# EAGLE design cerebellar V1.1 (EAGLE 9.6.2)
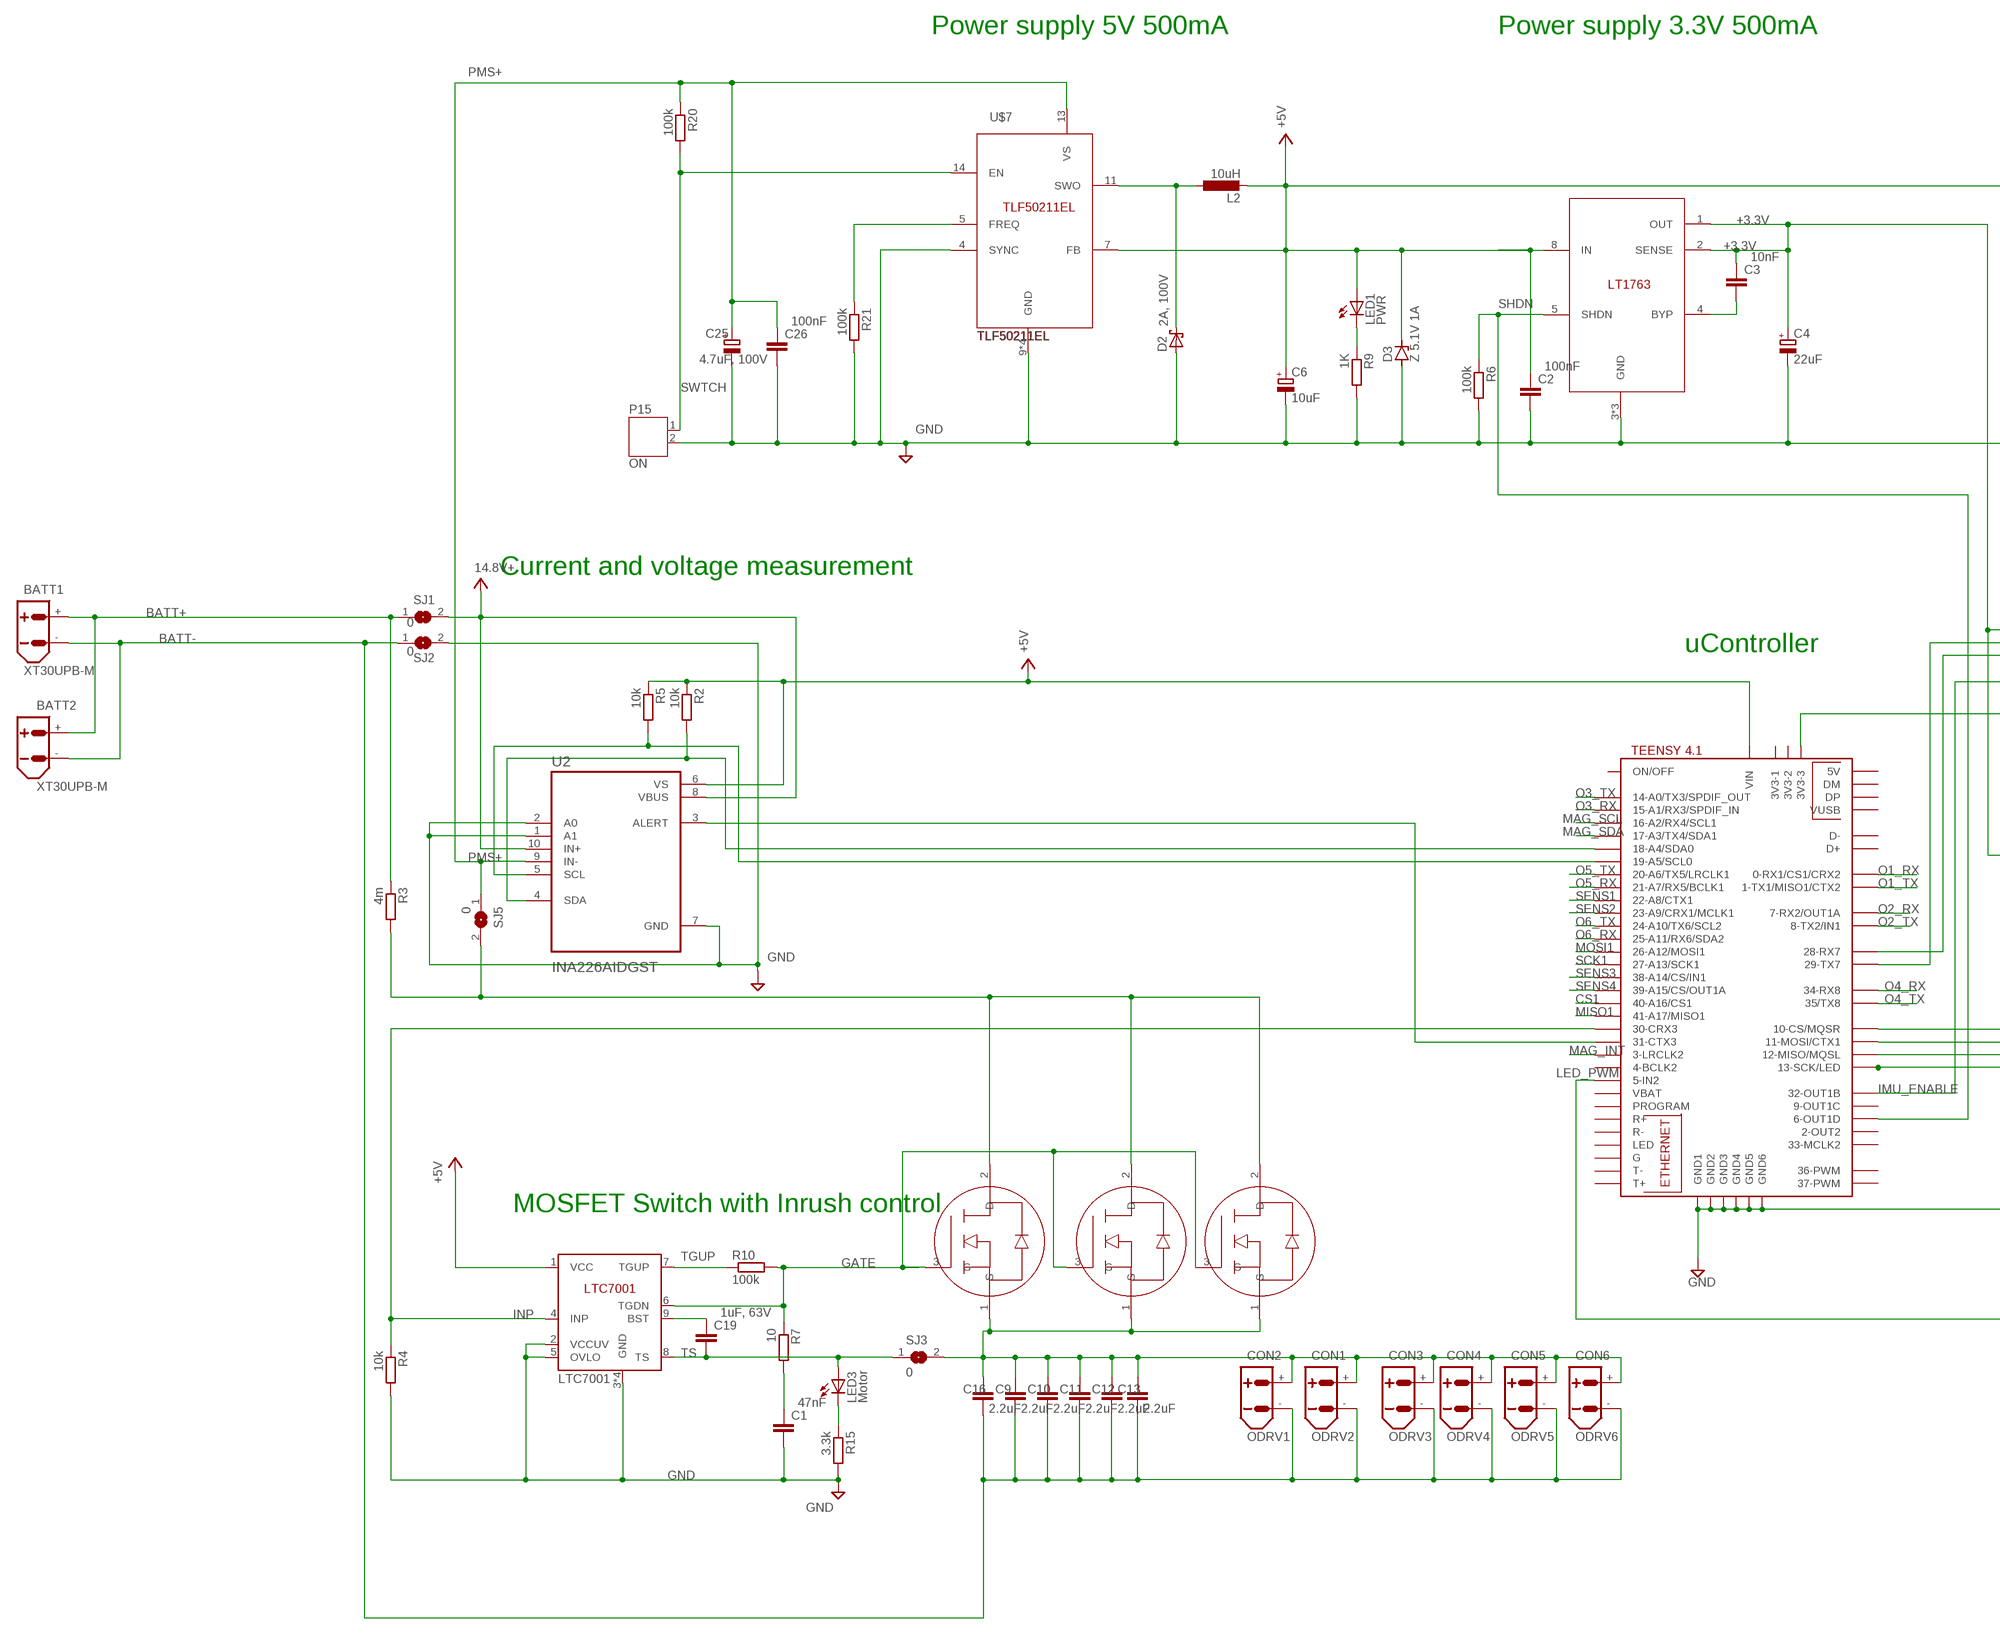
[diagram p0: schematic, sheet 1, part 1 of 2]
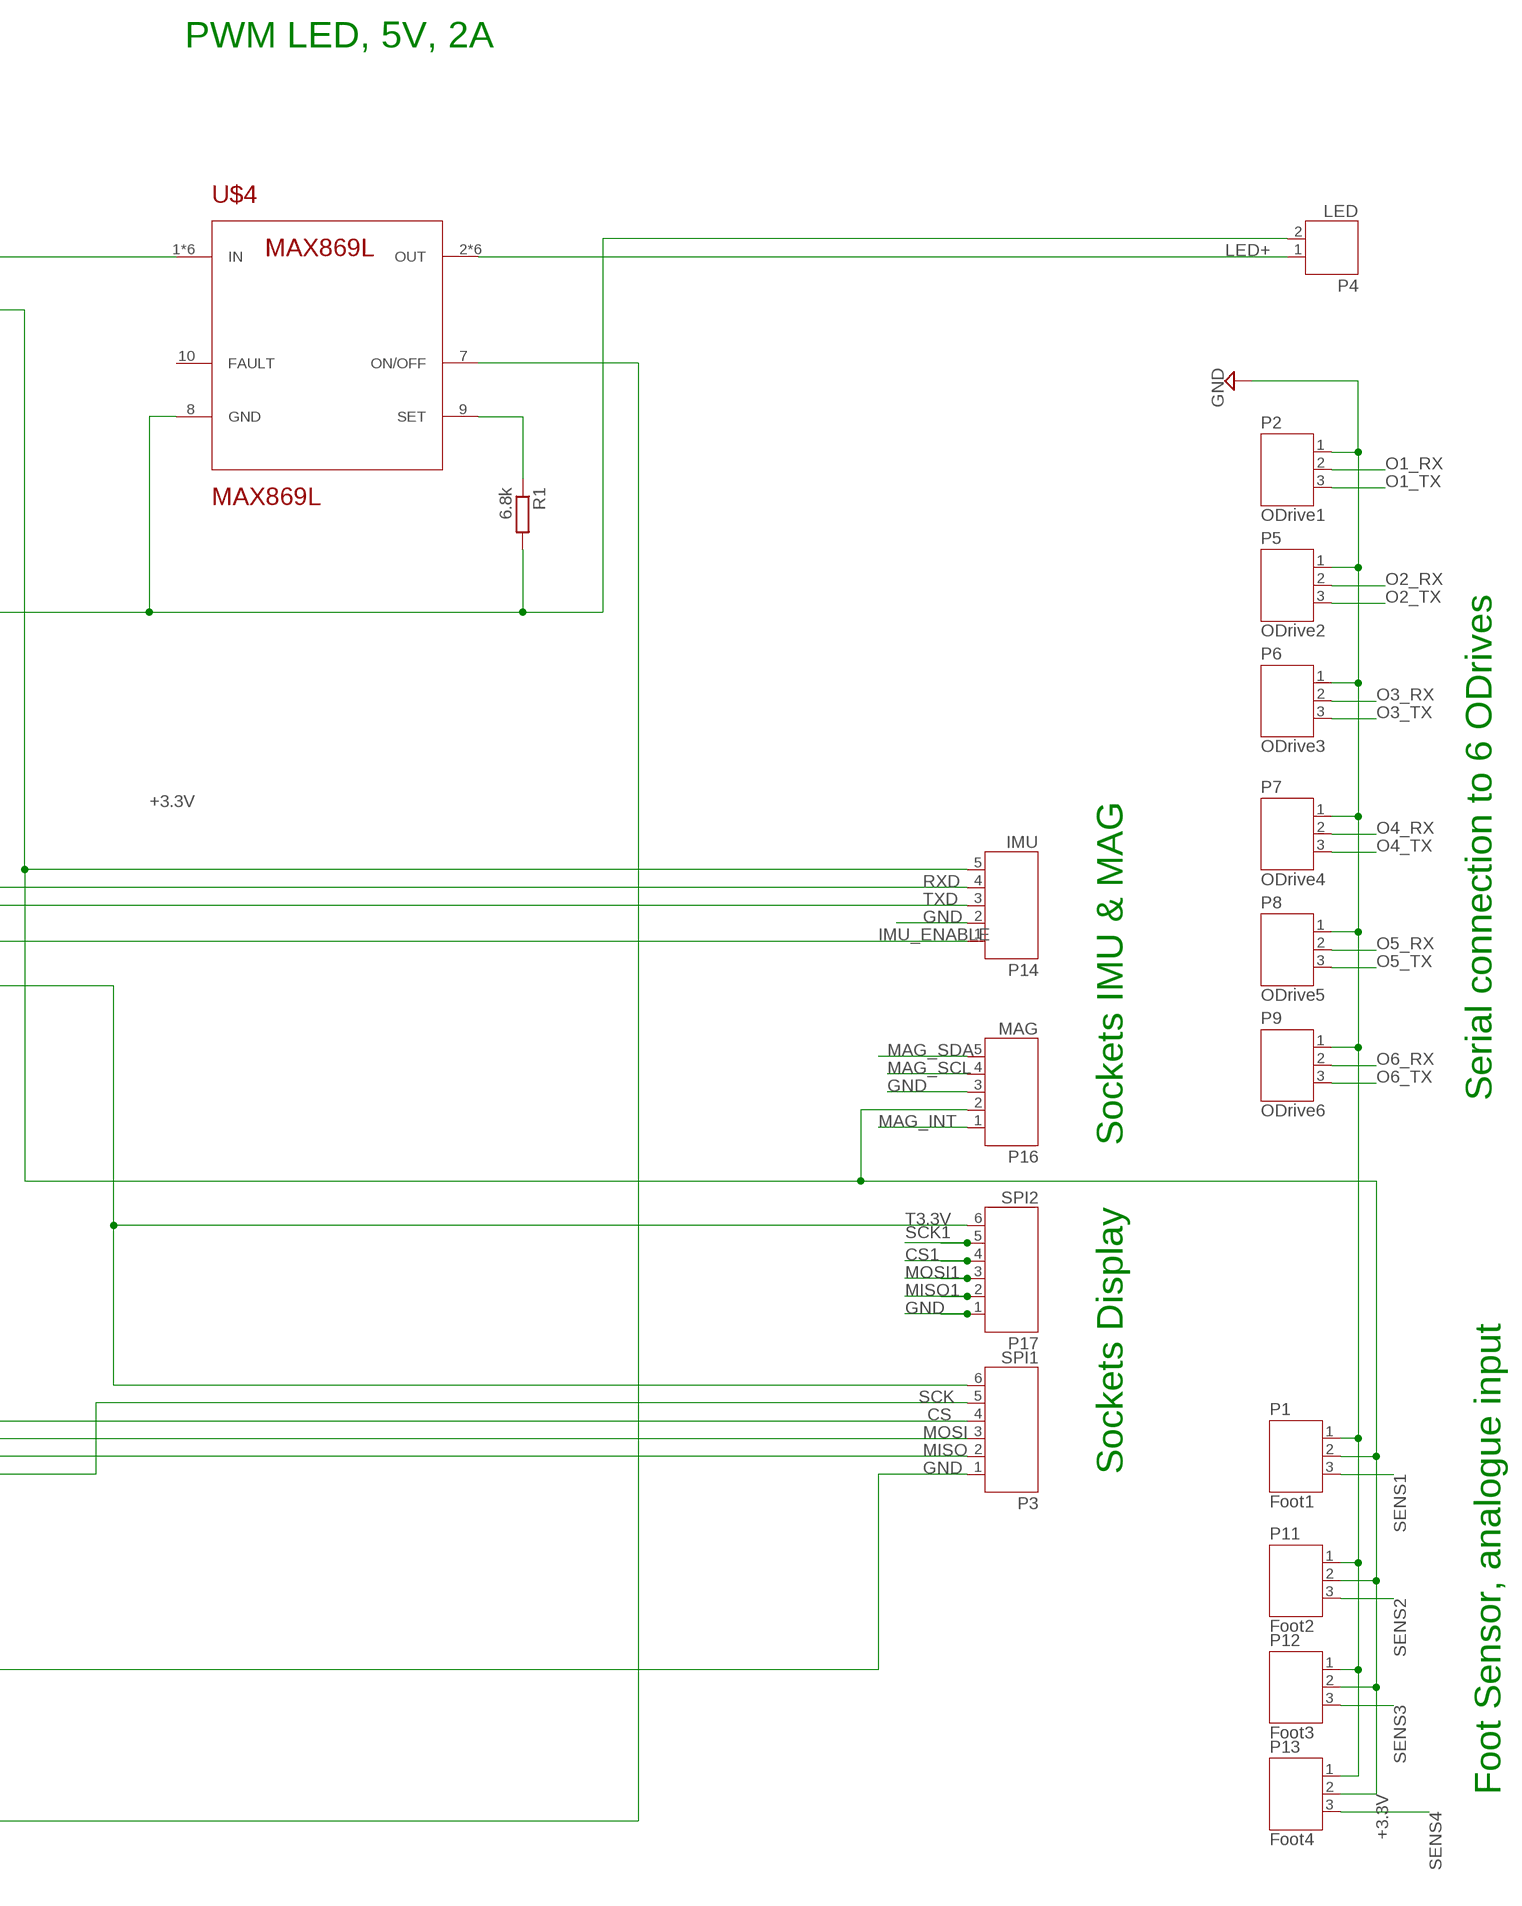
[diagram p1: schematic, sheet 1, part 2 of 2]

## Parts
BATT1  XT30UPB-M  [XT30UPB-M]
BATT2  XT30UPB-M  [XT30UPB-M]
C1  47nF  C-EU050-024X044  [C050-024X044]
C2  100nF  C-EU050-024X044  [C050-024X044]
C3  10nF  C-EU050-024X044  [C050-024X044]
C4  22uF  CPOL-EUE2-4  [E2-4]
C6  10uF  CPOL-EUE2-4  [E2-4]
C9  2.2uF  C-EU050-024X044  [C050-024X044]
C10  2.2uF  C-EU050-024X044  [C050-024X044]
C11  2.2uF  C-EU050-024X044  [C050-024X044]
C12  2.2uF  C-EU050-024X044  [C050-024X044]
C13  2.2uF  C-EU050-024X044  [C050-024X044]
C16  2.2uF  C-EU050-024X044  [C050-024X044]
C19  1uF, 63V  C-EU050-024X044  [C050-024X044]
C25  4.7uF, 100V  CPOL-EUE2-4  [E2-4]
C26  100nF  C-EU050-024X044  [C050-024X044]
CON1  ODRV2  XT30UPB-F  [XT30UPB-F]
CON2  ODRV1  XT30UPB-F  [XT30UPB-F]
CON3  ODRV3  XT30UPB-F  [XT30UPB-F]
CON4  ODRV4  XT30UPB-F  [XT30UPB-F]
CON5  ODRV5  XT30UPB-F  [XT30UPB-F]
CON6  ODRV6  XT30UPB-F  [XT30UPB-F]
D2  2A, 100V  SCHOTTKY-DIODEDO41  [DO41-10]
D3  Z 5.1V 1A  ZENER-DIODEDO41Z10  [DO41Z10]
IC3  LTC7001  [MSOP10]
L2  10uH  L-EUIRF-3  [IRF-3]
LED1  PWR  LED3MM  [LED3MM]
LED3  Motor  LED3MM  [LED3MM]
P1  Foot1  JST-PH3  [JST-PH3]
P2  ODrive1  JST-PH3  [JST-PH3]
P3  SPI1  JST-PH6  [JST-PH6]
P4  LED  JST-PH2  [JST-PH2]
P5  ODrive2  JST-PH3  [JST-PH3]
P6  ODrive3  JST-PH3  [JST-PH3]
P7  ODrive4  JST-PH3  [JST-PH3]
P8  ODrive5  JST-PH3  [JST-PH3]
P9  ODrive6  JST-PH3  [JST-PH3]
P11  Foot2  JST-PH3  [JST-PH3]
P12  Foot3  JST-PH3  [JST-PH3]
P13  Foot4  JST-PH3  [JST-PH3]
P14  IMU  JST-PH5  [JST-PH5]
P15  ON  JST-PH2  [JST-PH2]
P16  MAG  JST-PH5  [JST-PH5]
P17  SPI2  JST-PH6  [JST-PH6]
R1  6.8k  R-EU_0204/7  [0204/7]
R2  10k  R-EU_0204/7  [0204/7]
R3  4m  R-EU_R2512  [R2512]
R4  10k  R-EU_0204/7  [0204/7]
R5  10k  R-EU_0204/7  [0204/7]
R6  100k  R-EU_0204/7  [0204/7]
R7  10  R-EU_0204/7  [0204/7]
R9  1K  R-EU_0204/7  [0204/7]
R10  100k  R-EU_0204/7  [0204/7]
R15  3.3k  R-EU_0204/7  [0204/7]
R20  100k  R-EU_0204/7  [0204/7]
R21  100k  R-EU_0204/7  [0204/7]
SJ1  0  SJ  [SJ]
SJ2  0  SJ  [SJ]
SJ3  0  SJ  [SJ]
SJ5  0  SJ  [SJ]
U2  INA226AIDGST  [SOP50P490X110-10N]
U$1  TEENSY41  [TEENSY41]
U$2  IRF2804-BACK  [TO-220H-BACK]
U$3  IRF2804-BACK  [TO-220H-BACK]
U$4  MAX869L  MAX769L  [TSSOP-16]
U$5  IRF2804-BACK  [TO-220H-BACK]
U$7  TLF50211EL  [TSSOP-14]
U$8  LT1763  [SO08]

## Nets
+3.3V: C3.1 C4.+ P1.2 P11.2 P12.2 P13.2 P14.5 P16.2 U$8.1(OUT) U$8.2(SENSE)
+5V: C2.1 C6.+ D3.C IC3.1(VCC) L2.2 LED1.A R2.1 R5.1 U2.6(VS) U$1.VIN U$4.1(IN) U$4.4(IN) U$4.5(IN) U$4.12(IN) U$4.13(IN) U$4.16(IN) U$7.7(FB) U$8.8(IN)
BATT+ [Battery]: BATT1.+ BATT2.+ R3.1 SJ1.1
BATT- [Battery]: BATT1.- BATT2.- C9.2 C10.2 C11.2 C12.2 C13.2 C16.2 CON1.- CON2.- CON3.- CON4.- CON5.- CON6.- SJ2.1
CS: P3.4 U$1.10-CS\MQSR(10-CS/MQSR)
CS1: P17.4 U$1.40-A16/CS1
DRAIN [Battery]: R3.2 SJ5.2 U$2.2(D) U$3.2(D) U$5.2(D)
GATE: IC3.6(TGDN) R7.1 R10.2 U$2.3(G) U$3.3(G) U$5.3(G)
GND: C1.2 C2.2 C4.- C6.- C25.- C26.2 D2.A D3.A IC3.2(VCCUV) IC3.3(GND) IC3.5(OVLO) IC3.10(GND) IC3.11(GND) IC3.12(GND) P1.1 P2.1 P3.1 P4.2 P5.1 P6.1 P7.1 P8.1 P9.1 P11.1 P12.1 P13.1 P14.2 P15.2 P16.3 P17.1 R1.2 R4.2 R6.2 R9.2 R15.2 R21.2 SJ2.2 U2.1(A1) U2.2(A0) U2.7(GND) U$1.GND1 U$1.GND2 U$1.GND3 U$1.GND4 U$1.GND5 U$1.GND6 U$4.8(GND) U$7.4(SYNC) U$7.9(GND) U$7.10(GND) U$7.15(GND) U$7.16(GND) U$8.3(GND) U$8.6(GND) U$8.7(GND)
IMU_ENABLE: P14.1 U$1.32-OUT1B
INP: IC3.4(INP) R4.1 U$1.30-CRX3
LED+: P4.1 U$4.2(OUT) U$4.3(OUT) U$4.6(OUT) U$4.11(OUT) U$4.14(OUT) U$4.15(OUT)
LED_PWM: U$1.5-IN2 U$4.7(ON/OFF)
MAG_INT: P16.1 U$1.3-LRCLK2
MAG_SCL: P16.4 U$1.16-A2/RX4/SCL1
MAG_SDA: P16.5 U$1.17-A3/TX4/SDA1
MISO: P3.2 U$1.12-MISO/MQSL
MISO1: P17.2 U$1.41-A17/MISO1
MOSI: P3.3 U$1.11-MOSI/CTX1
MOSI1: P17.3 U$1.26-A12/MOSI1
N$1: C1.1 R7.2
N$2: R1.1 U$4.9(SET)
N$5: U2.3(ALERT) U$1.31-CTX3
N$8: C3.2 U$8.4(BYP)
N$17: R5.2 U2.5(SCL) U$1.19-A5/SCL0
N$22: R2.2 U2.4(SDA) U$1.18-A4/SDA0
N$24: C19.1 IC3.9(BST)
N$30: LED3.K(C) R15.1
N$39: LED1.K(C) R9.1
N$42: D2.C L2.1 U$7.11(SWO)
N$46: R21.1 U$7.5(FREQ)
O1_RX: P2.2 U$1.0-RX1/CS1/CRX2
O1_TX: P2.3 U$1.1-TX1/MISO1/CTX2
O2_RX: P5.2 U$1.7-RX2/OUT1A
O2_TX: P5.3 U$1.8-TX2/IN1
O3_RX: P6.2 U$1.15-A1/RX3/SPDIF_IN
O3_TX: P6.3 U$1.14-A0/TX3/SPDIF_OUT
O4_RX: P7.2 U$1.34-RX8
O4_TX: P7.3 U$1.35-TX8(35/TX8)
O5_RX: P8.2 U$1.21-A7/RX5/BCLK1
O5_TX: P8.3 U$1.20-A6/TX5/LRCLK1
O6_RX: P9.2 U$1.25-A11/RX6/SDA2
O6_TX: P9.3 U$1.24-A10/TX6/SCL2
PMS+: C25.+ C26.1 R20.1 SJ5.1 U2.9(IN-) U$7.13(VS)
POWER+ [Battery]: C9.1 C10.1 C11.1 C12.1 C13.1 C16.1 CON1.+ CON2.+ CON3.+ CON4.+ CON5.+ CON6.+ SJ3.2 U$2.1(S) U$3.1(S) U$5.1(S)
RXD: P14.4 U$1.29-TX7
SCK: P3.5 U$1.13-SCK/LED
SCK1: P17.5 U$1.27-A13/SCK1
SENS1: P1.3 U$1.22-A8/CTX1
SENS2: P11.3 U$1.23-A9/CRX1/MCLK1
SENS3: P12.3 U$1.38-A14/CS/IN1
SENS4: P13.3 U$1.39-A15/CS/OUT1A
SHDN: R6.1 U$1.6-OUT1D U$8.5(SHDN)
SWTCH: P15.1 R20.2 U$7.14(EN)
T3.3V: P3.6 P17.6 U$1.3V3-3
TGUP: IC3.7(TGUP) R10.1
TS: C19.2 IC3.8(TS) LED3.A SJ3.1
TXD: P14.3 U$1.28-RX7
V+: SJ1.2 U2.8(VBUS) U2.10(IN+) ; supply symbol labelled 14.8V+
Unconnected: U$1.2-OUT2 U$1.3V3-1 U$1.3V3-2 U$1.4-BCLK2 U$1.9-OUT1C U$1.33-MCLK2 U$1.36-PWM U$1.37-PWM U$1.+5V(5V) U$1.D+ U$1.D- U$1.DM U$1.DP U$1.G U$1.LED U$1.ON/OFF U$1.PROGRAM U$1.R+ U$1.R- U$1.T+ U$1.T- U$1.VBAT U$1.VUSB U$4.10(FAULT)

## Notes on the sheet
- Power supply 5V 500mA | Power supply 3.3V 500mA | PWM LED, 5V, 2A
- Serial connection to 6 ODrives
- Current and voltage measurement
- uController
- Sockets IMU & MAG
- Foot Sensor, analogue input
- Sockets Display
- MOSFET Switch with Inrush control

## Library data of the parts
BATT1 BATT2 CON1-CON6 = amass:XT30: AMASS XT30 connector Store in Japan AMASS XT30 connector <https://szc.jp/ams-xt30>
C1-C3 C9-C13 C16 C19 C26 = rcl:C-EU: CAPACITOR, European symbol; SPICEPREFIX: C
C4 C6 C25 = rcl:CPOL-EU: POLARIZED CAPACITOR, European symbol; SPICEPREFIX: C
D2 = adafruit:SCHOTTKY-DIODE: Schottky Diode
D3 = diode:ZENER-DIODE: Z-Diode
IC3 = LTC7001:LTC7001: Fast 150V High Side NMOS Static Switch Driver Source: https://www.analog.com/en/products/ltc7001.html; MPN: AD7992BRMZ-0; OC_FARNELL: 1078311; OC_NEWARK: 31M4422
L2 = rcl:L-EU: INDUCTOR, European symbol; SPICEPREFIX: L
LED1 LED3 = adafruit:LED: LED OSRAM: - CHIPLED LG R971, LG N971, LY N971, LG Q971, LY Q971, LO R971, LY R971 LH N974, LH R974 LS Q976, LO Q976, LY Q976 LO Q996 - Hyper CHIPLED LW Q18S LB Q993, LB Q99A, LB R99A - SideLED LS A670, LO A670, LY A670, LG A670, LP A670 LB A673, LV A673, LT A673, LW A673 LH A674 LY A675 LS A676, LA A676, LO A676, LY A676, LW A676 LS A679, LY A679, LG A679 - Hyper Micro SIDELED® LS Y876, LA Y876, LO Y876, LY Y876 LT Y87S - SmartLED LW L88C, LW L88S LB L89C, LB L89S, LG L890 LS L89K, LO L89K, LY L89K LS L896, LA L896, LO L896, LY L896 - TOPLED LS T670, LO T670, LY T670, LG T670, LP T670 LSG T670, LSP T670, LSY T670, LOP T670, LYG T670 LG T671, LOG T671, LSG T671 LB T673, LV T673, LT T673, LW T673 LH T674 LS T676, LA T676, LO T676, LY T676, LB T676, LH T676, LSB T676, LW T676 LB T67C, LV T67C, LT T67C, LS T67K, LO T67K, LY T67K, LW E67C LS E67B, LA E67B, LO E67B, LY E67B, LB E67C, LV E67C, LT E67C LW T67C LS T679, LY T679, LG T679 LS T770, LO T770, LY T770, LG T770, LP T770 LB T773, LV T773, LT T773, LW T773 LH T774 LS E675, LA E675, LY E675, LS T675 LS T776, LA T776, LO T776, LY T776, LB T776 LHGB T686 LT T68C, LB T68C - Hyper Mini TOPLED® LB M676 - Mini TOPLED Santana® LG M470 LS M47K, LO M47K, LY M47K Source: http://www.osram.convergy.de/
P1 P2 P5-P9 P11-P13 = jst-ph:JST-PH3
P3 P17 = jst-ph:JST-PH6
P4 P15 = jst-ph:JST-PH2
P14 P16 = jst-ph:JST-PH5
R1 R2 R4-R7 R9 R10 R15 R20 R21 = rcl:R-EU_: RESISTOR, European symbol; SPICEPREFIX: R
R3 = rcl:R-EU_: RESISTOR, European symbol; DIGIKEY: 541-WSK25124L000FEACT-ND; LINK: https://octopart.com/wsk25124l000fea-vishay-41934978?r=sp; MOUSER: 71-WSK25124L000FEA; SPICEPREFIX: R
SJ1-SJ3 SJ5 = jumper:SJ: SMD solder JUMPER
U2 = INA226AIDGST:INA226AIDGST: Check availability <https://pricing.snapeda.com/parts/INA226AIDGST/Texas%20Instruments/view-part?ref=eda>; AVAILABILITY: In Stock; DESCRIPTION: 36V, 16-bit, ultra-precise i2c output current/voltage/power monitor w/alert; MF: Texas Instruments; MP: INA226AIDGST; PACKAGE: VSSOP-10 Texas Instruments; PRICE: None; PURCHASE-URL: https://pricing.snapeda.com/search/part/INA226AIDGST/?ref=eda
U$1 = teensy:TEENSY41
U$2 U$3 U$5 = IRF2804:IRF2804-BACK: N-Channel Power MOSFET
U$4 = MAX869:MAX769L: MAX869L 2A, Current-Limited, High-Side P-Channel Switch with Thermal Shutdown
U$7 = TLF50211EL:TLF50211EL: TLF50211EL 2.2 MHz Step-Down Regulator 500 mA, 5 V, low quiescent current https://www.infineon.com/dgdl/Infineon-TLF50211EL-DS-v01_10-EN.pdf?fileId=5546d46258fc0bc1015969d2af9641e9
U$8 = LT1763:LT1763

## Net classes
0 default: width 0.254 mm
1 Battery: width 1.575 mm

## Board
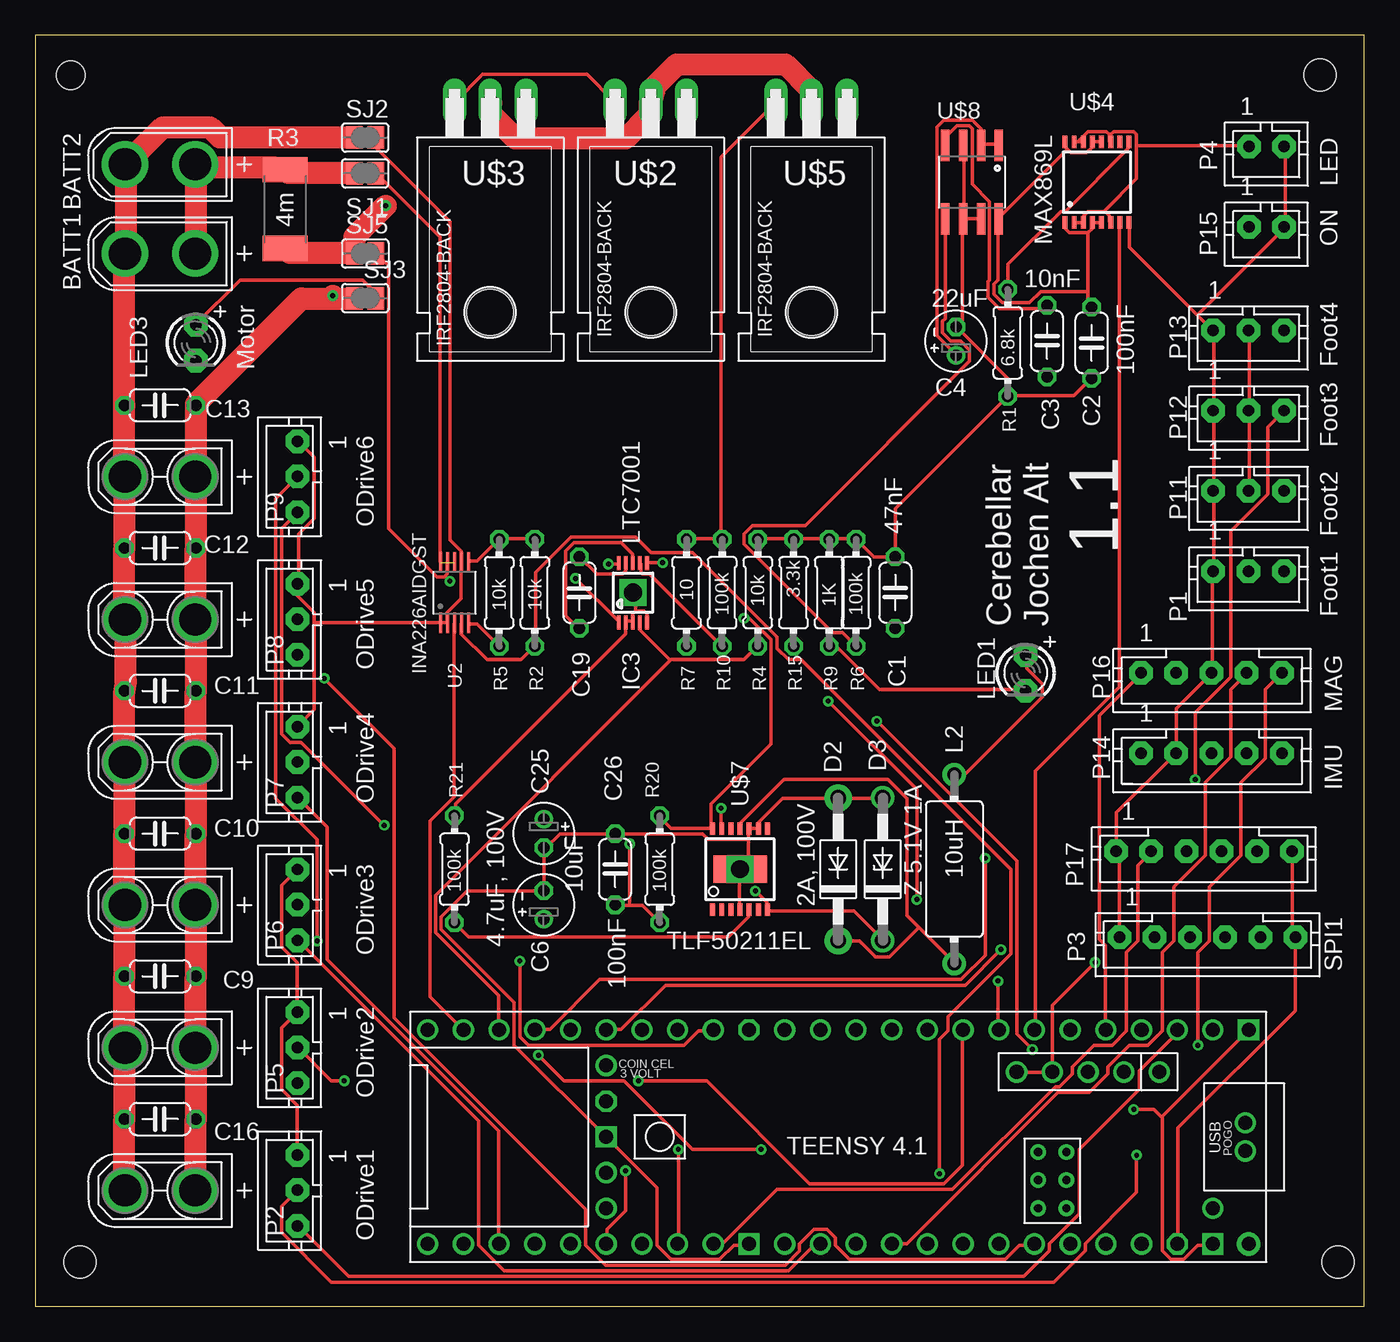
[diagram p2: board, top side]
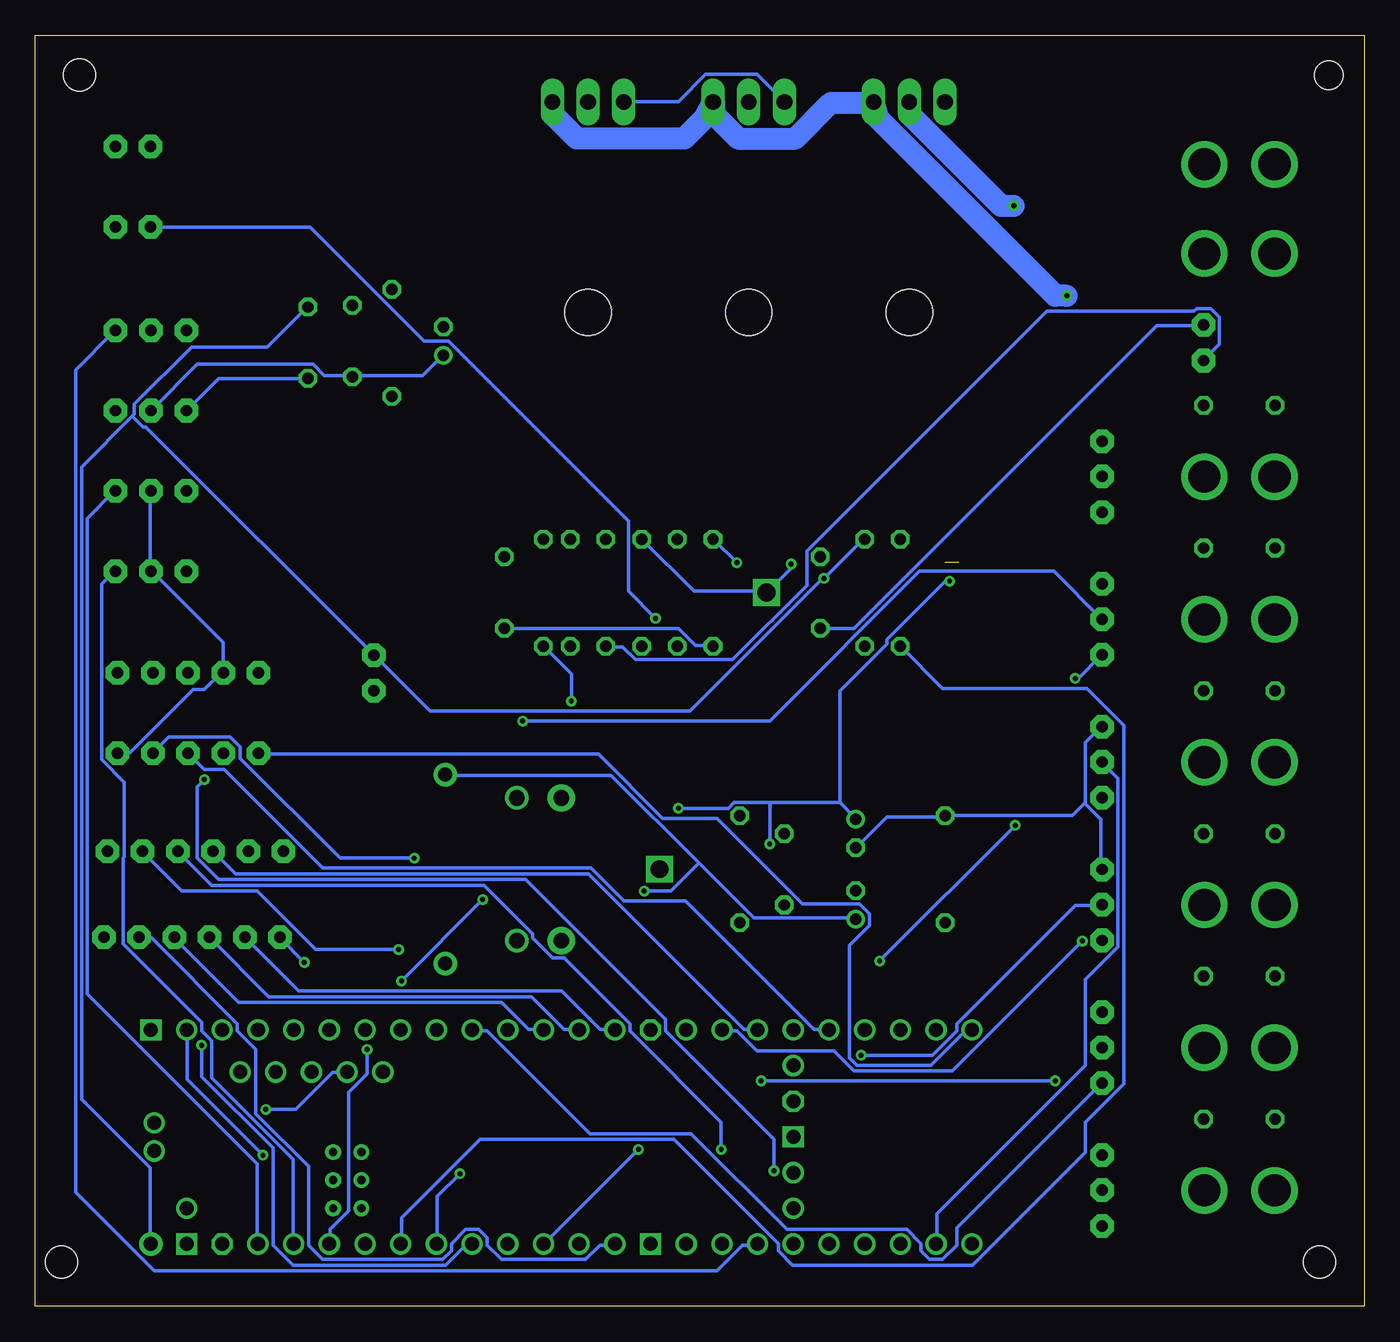
[diagram p3: board, bottom side, seen from below]

Size 94.59 x 90.47 mm. Coordinates in mm from the lower left corner, seen from the top.
Outline: 0,0 94.59,0 94.59,90.47 0,90.47 0,0
Copper layers (1*16): Top 0.035mm / dielectric 1.5mm / Bottom 0.035mm
Design rules "default": minimum track width 6mil, minimum drill 0.35mm, track to track 6mil, track to pad 6mil, pad to pad 6mil, via to via 6mil, smd to smd 6mil, copper to edge 40mil, drill to drill 6mil, minimum pad ring 10mil, minimum via ring 8mil, stop-mask expansion 4mil, vias tented up to drill 0mil, thermal gap 10mil
Holes 2.03 mm at 2.54,87.63
Holes 2.29 mm at 3.17,3.17 91.44,87.63 92.71,3.17

### Footprints (pad centres in the part's own frame; a part is rotated, then mirrored left to right if it is on the bottom)
XT30UPB-M = drill 2.286: + 2.5,0; - -2.5,0
C050-024X044 = drill 0.813 octagon: 1 -2.54,0; 2 2.54,0
E2-4 = drill 0.813 pad 1.27: + -1.016,0 | drill 0.813 pad 1.27 octagon: - 1.016,0
XT30UPB-F = drill 2.286: + 2.5,0; - -2.5,0
DO41-10 = drill 1.118 pad 1.93: A 5.08,0; C -5.08,0
DO41Z10 = drill 1.118: A 5.08,0; C -5.08,0
MSOP10 = smd 0.25 x 1: 1 -1,-2.113; 2 -0.5,-2.113; 3 0,-2.113; 4 0.5,-2.113; 5 1,-2.113; 6 1,2.113; 7 0.5,2.113; 8 0,2.113; 9 -0.5,2.113; 10 -1,2.113 | drill 1.27 square: 11 0,0 | smd 1.524 x 1.524: 12 0,0
IRF-3 = drill 1 pad 1.676: 1 -6.705,0; 2 6.73,0
LED3MM = drill 0.813 pad 1.676 octagon: A -1.27,0; K 1.27,0
JST-PH3 = drill 0.813 pad 1.676 octagon: 1 2.524,-1.524; 2 0.016,-1.524; 3 -2.524,-1.524
JST-PH6 = drill 0.813 pad 1.676 octagon: 1 6.27,0; 2 3.762,0; 3 1.254,0; 4 -1.254,0; 5 -3.762,0; 6 -6.27,0
JST-PH2 = drill 0.813 pad 1.676 octagon: 1 1.254,0; 2 -1.254,0
JST-PH5 = drill 0.813 pad 1.676 octagon: 1 5.762,0; 2 3.254,0; 3 0.746,0; 4 -1.762,0; 5 -4.27,0
0204/7 = drill 0.813 octagon: 1 -3.81,0; 2 3.81,0
R2512 = smd 1.8 x 3.2: 1 -2.8,0; 2 2.8,0
SJ = smd 1.168 x 1.6: 1 -0.762,0; 2 0.762,0
SOP50P490X110-10N = smd 1.47 x 0.28: 1 -2.15,1; 2 -2.15,0.5; 3 -2.15,0; 4 -2.15,-0.5; 5 -2.15,-1; 6 2.15,-1; 7 2.15,-0.5; 8 2.15,0; 9 2.15,0.5; 10 2.15,1
TEENSY41 = drill 1: 0-RX1/CS1/CRX2 -27.94,-7.62; 1-TX1/MISO1/CTX2 -25.4,-7.62; 2-OUT2 -22.86,-7.62; 3-LRCLK2 -20.32,-7.62; 4-BCLK2 -17.78,-7.62; 5-IN2 -15.24,-7.62; 6-OUT1D -12.7,-7.62; 7-RX2/OUT1A -10.16,-7.62; 8-TX2/IN1 -7.62,-7.62; 9-OUT1C -5.08,-7.62; 10-CS\MQSR -2.54,-7.62; 11-MOSI/CTX1 0,-7.62; 12-MISO/MQSL 2.54,-7.62; 13-SCK/LED 2.54,7.62; 14-A0/TX3/SPDIF_OUT 0,7.62; 15-A1/RX3/SPDIF_IN -2.54,7.62; 16-A2/RX4/SCL1 -5.08,7.62; 17-A3/TX4/SDA1 -7.62,7.62; 18-A4/SDA0 -10.16,7.62; 19-A5/SCL0 -12.7,7.62; 20-A6/TX5/LRCLK1 -15.24,7.62; 21-A7/RX5/BCLK1 -17.78,7.62; 22-A8/CTX1 -20.32,7.62; 23-A9/CRX1/MCLK1 -22.86,7.62; 24-A10/TX6/SCL2 7.62,-7.62; 25-A11/RX6/SDA2 10.16,-7.62; 26-A12/MOSI1 12.7,-7.62; 27-A13/SCK1 15.24,-7.62; 28-RX7 17.78,-7.62; 29-TX7 20.32,-7.62; 30-CRX3 22.86,-7.62; 31-CTX3 25.4,-7.62; 32-OUT1B 27.94,-7.62; 33-MCLK2 27.94,7.62; 34-RX8 25.4,7.62; 35-TX8 22.86,7.62; 36-PWM 20.32,7.62; 37-PWM 17.78,7.62; 38-A14/CS/IN1 15.24,7.62; 39-A15/CS/OUT1A 12.7,7.62; 40-A16/CS1 10.16,7.62; 41-A17/MISO1 7.62,7.62; +5V -24.13,-4.62; D+ -30.25,-1; D- -30.25,1; DM -21.59,-4.62; DP -19.05,-4.62; GND4 -16.51,-4.62; GND5 -13.97,-4.62; ON/OFF 15.24,5.08; PROGRAM 15.24,2.54; VBAT 15.24,-5.08; VUSB -27.94,5.08 | drill 1 octagon: 3V3-1 5.08,-7.62; 3V3-2 15.24,-2.54; 3V3-3 -25.4,7.62 | drill 0.6: G -15.51,3.08; LED -17.51,3.08; R+ -17.51,5.08; R- -15.51,5.08; T+ -15.51,1.08; T- -17.51,1.08 | drill 1 square: GND1 -30.48,-7.62; GND2 15.24,0; GND3 5.08,7.62; GND6 -27.94,7.62 | drill 1 pad 1.676: VIN -30.48,7.62
TO-220H-BACK = drill 1.118 long: 1 -2.54,-7.62; 2 0,-7.62; 3 2.54,-7.62 | hole 3.302: 0,7.366
TSSOP-16 = smd 0.9 x 0.35: 1 -2.875,2.275; 2 -2.875,1.625; 3 -2.875,0.975; 4 -2.875,0.325; 5 -2.875,-0.325; 6 -2.875,-0.975; 7 -2.875,-1.625; 8 -2.875,-2.275; 9 2.875,-2.275; 10 2.875,-1.625; 11 2.875,-0.975; 12 2.875,-0.325; 13 2.875,0.325; 14 2.875,0.975; 15 2.875,1.625; 16 2.875,2.275
TSSOP-14 = smd 0.9 x 0.35: 1 -2.875,1.95; 2 -2.875,1.3; 3 -2.875,0.65; 4 -2.875,0; 5 -2.875,-0.65; 6 -2.875,-1.3; 7 -2.875,-1.95; 8 2.875,-1.95; 9 2.875,-1.3; 10 2.875,-0.65; 11 2.875,0; 12 2.875,0.65; 13 2.875,1.3; 14 2.875,1.95 | smd 1.93 x 3.81: 15 0,0 | drill 1.27 square: 16 0,0
SO08 = smd 0.61 x 2.21: 1 -1.905,-2.616; 2 -0.635,-2.616; 3 0.635,-2.616; 4 1.905,-2.616; 5 1.905,2.616; 6 0.635,2.616; 7 -0.635,2.616; 8 -1.905,2.616

### Placement (x,y rotation side)
BATT1  8.89,74.93 0 top
BATT2  8.89,81.28 0 top
C1  61.21,50.8 90 top
C2  75.18,68.58 270 top
C3  72.01,68.71 90 top
C4  65.53,68.71 90 top
C6  36.2,28.57 90 top
C9  8.89,23.5 180 top
C10  8.89,33.66 180 top
C11  8.89,43.81 180 top
C12  8.89,53.98 180 top
C13  8.89,64.14 180 top
C16  8.89,13.34 180 top
C19  38.73,50.8 270 top
C25  36.2,33.66 270 top
C26  41.27,31.11 90 top
CON1  8.89,18.41 0 top
CON2  8.89,8.26 0 top
CON3  8.89,28.57 0 top
CON4  8.89,38.73 0 top
CON5  8.89,48.9 0 top
CON6  8.89,59.05 0 top
D2  57.15,31.11 90 top
D3  60.33,31.11 90 top
IC3  42.55,50.8 0 top
L2  65.41,31.11 90 top
LED1  70.48,45.09 270 top
LED3  11.43,68.58 270 top
P1  86.36,50.8 180 top
P2  17.14,8.26 90 top
P3  83.44,26.29 180 top
P4  87.63,82.55 180 top
P5  17.14,18.41 90 top
P6  17.14,28.57 90 top
P7  17.14,38.73 90 top
P8  17.14,48.9 90 top
P9  17.14,59.05 90 top
P11  86.36,56.52 180 top
P12  86.36,62.23 180 top
P13  86.36,67.94 180 top
P14  84.45,39.37 180 top
P15  87.63,76.83 180 top
P16  84.45,45.09 180 top
P17  83.18,32.38 180 top
R1  69.22,68.58 270 top
R2  35.56,50.8 270 top
R3  17.78,78.11 270 top
R4  51.44,50.8 90 top
R5  33.02,50.8 270 top
R6  58.42,50.8 90 top
R7  46.36,50.8 270 top
R9  56.52,50.8 90 top
R10  48.9,50.8 90 top
R15  53.98,50.8 90 top
R20  44.45,31.11 90 top
R21  29.84,31.11 90 top
SJ1  23.49,80.64 0 top
SJ2  23.49,83.19 0 top
SJ3  23.49,71.75 180 top
SJ5  23.49,74.93 180 top
U2  29.84,50.8 90 top
U$1  55.88,12.06 180 top
U$2  43.82,78.11 180 top
U$3  32.38,78.11 180 top
U$4  75.56,80.01 90 top
U$5  55.25,78.11 180 top
U$7  50.16,31.11 90 top
U$8  66.67,80.01 180 top

### Tracks (layer width: path | path; a pad name or v marks a point on that pad's centre or on a via)
+3.3V
  Top 0.254: U$8.1 68.53,82.7 67.31,82.7 U$8.2 67.31,83.82 66.7,84.43 64.67,84.43 64.16,83.92 64.16,69.09 65.48,67.77 C4.+ | P13.2 86.41,69.39 86.41,63.8 P12.2 86.41,63.7 86.41,58.12 P11.2
  Bottom 0.254: C4.+ 65.58,67.67 67,66.24 71.98,66.24 C3.1 72.08,66.24 74.02,66.24 74.83,67.06 83.06,67.06 86.31,63.8 P12.2 | P14.5 88.65,39.42 87.83,39.42 83.36,43.89 82.55,43.89 81.33,45.11 P16.2 81.23,45.11 81.23,47.24 86.31,52.32 P1.2 86.41,52.43 86.41,58.01 P11.2
+5V  (via drill 0.35)
  Top 0.254: U2.6 30.94,53.03 31.45,53.03 R5.1 33.07,54.66 35.51,54.66 R2.1 | v38.46,51.82 41.5,48.77 IC3.1 | D3.C 60.3,26.11 58.27,28.14 52.17,28.14 U$7.7 52.07,28.35 52.07,28.75 v51.26,29.57 | LED1.A 70.56,46.33 70.56,45.41 71.68,44.3 71.68,43.38 66.19,37.9 65.48,37.9 L2.2 | 73.46,82.35 73.71,82.09 74.83,82.09 75.23,82.5 75.23,82.8 U$4.13 75.34,82.91 75.84,82.91 U$4.12 | 73.46,82.35 73.3,82.5 73.3,82.8 U$4.16 | 73.46,82.35 68.53,77.42 U$8.8 68.53,77.32 68.53,73.05 68.22,72.75 68.22,72.03 68.83,71.42 70.76,71.42 71.58,72.24 74.93,72.24 | 74.93,76.4 73.61,76.4 73.3,76.71 73.3,77.11 U$4.1 | 74.93,76.4 75.23,76.71 75.23,77.11 U$4.4 75.34,77.11 75.84,77.11 U$4.5 | 74.93,72.24 74.93,71.32 75.13,71.12 C2.1 | 74.93,72.24 74.93,76.4
  Bottom 0.254: R2.1 35.61,54.66 v38.46,51.82 38.56,51.82 48.01,42.37 66.5,42.37 LED1.A 86.72,62.59 86.92,62.59 87.68,63.35 | 47.35,31.55 53.59,37.8 65.38,37.8 L2.2 | 47.35,31.55 43.43,27.64 36.22,27.64 C6.+ | v51.26,29.57 49.33,29.57 47.35,31.55 | 87.68,63.35 87.53,63.5 87.53,64.21 83.46,68.28 78.08,68.28 75.23,71.12 C2.1 | 87.68,63.35 91.29,59.74 91.29,14.73 86.41,9.86 86.41,4.47 U$1.VIN
BATT+
  Top 1.575: SJ1.1 22.71,80.67 18.03,80.67 17.83,80.87 R3.1 17.02,81.08 11.63,81.08 11.43,81.28 BATT2.+ 11.43,80.37 11.43,74.98 BATT1.+
BATT-
  Top 1.575: SJ2.1 22.71,83.21 13.16,83.21 12.45,83.92 9.09,83.92 6.45,81.28 BATT2.- 6.45,80.57 6.45,74.98 BATT1.- 6.35,74.17 C13.2 6.35,64.11 6.35,59.13 CON6.- 6.35,58.32 C12.2 6.35,53.95 6.35,48.97 CON5.- 6.45,48.16 6.45,44.5 6.35,43.79 | CON2.- 6.35,8.33 6.35,13.31 C16.2 6.35,17.68 CON1.- 6.35,18.49 6.35,23.47 C9.2 6.35,27.84 CON3.- 6.35,28.65 6.35,33.63 C10.2 6.35,38 CON4.- 6.35,38.81 6.35,43.79 | 6.35,43.79 C11.2
CS
  Bottom 0.254: U$1.10-CS\MQSR 58.47,19.71 59.49,19.71 61.42,21.64 80.11,21.64 84.68,26.21 P3.4
CS1  (via drill 0.35)
  Top 0.254: v45.77,11.18 45.77,4.47 U$1.40-A16/CS1
  Bottom 0.254: v45.77,11.18 45.77,13.11 52.27,19.61 52.27,20.12 56.95,24.79 57.76,24.79 59.18,26.21 59.18,26.52 62.64,29.97 82.04,29.97 84.38,32.31 P17.4
DRAIN  (via drill 0.35)
  Top 1.575: R3.2 17.83,75.29 18.14,74.98 22.71,74.98 SJ5.2 22.71,75.69 22.71,76.1 v24.94,78.33 | U$3.2 32.46,85.65 32.46,84.84 34.19,83.11 42.01,83.11 43.74,84.84 43.74,85.65 U$2.2 44.04,86.46 44.04,86.77 45.67,88.39 53.39,88.39 55.22,86.56 55.22,85.75 U$5.2
  Bottom 1.575: v24.94,78.33 25.86,78.33 32.36,84.84 32.36,85.65 U$3.2
GATE  (via drill 0.35)
  Top 0.254: v44.65,52.93 43.64,52.93 IC3.6 | R7.1 46.38,54.66 48.82,54.66 R10.2 48.82,54.76 48.82,81.79 52.68,85.65 U$5.3 | U$3.3 29.92,85.75 31.85,87.68 39.27,87.68 41.2,85.75 U$2.3
  Bottom 0.254: v44.65,52.93 46.28,54.56 R7.1 | U$2.3 43.23,87.68 46.89,87.68 48.82,85.75 52.68,85.75 U$5.3
GND  (via drill 0.35)
  Top 0.254: U$1.GND3 50.75,4.37 49.73,4.37 48.72,3.35 45.26,3.35 44.25,4.37 44.25,8.43 40.69,11.99 U$1.GND2 40.59,12.09 34.09,18.59 34.09,21.64 28.91,26.82 28.91,27.74 30.73,29.57 36.12,29.57 C6.- 36.22,29.67 36.22,32.61 C25.- 36.32,32.61 37.34,33.63 41.2,33.63 C26.2 41.4,33.63 47.5,33.63 47.9,33.22 50.75,33.22 | U$7.4 50.14,28.25 50.14,31.09 U$7.16 50.75,31.7 50.75,33.22 | 50.75,33.22 50.75,33.93 U$7.10 50.85,34.04 51.46,34.04 U$7.9 51.46,34.14 51.46,34.44 53.19,36.17 57.05,36.17 D2.A 57.15,36.17 60.3,36.17 D3.A | SJ2.2 24.33,83.11 24.33,82.4 29.52,77.22 29.52,54.56 30.33,53.75 30.33,53.03 U2.7 30.33,52.93 30.33,50.39 29.31,49.38 29.31,48.77 U2.2 29.31,48.67 28.91,48.67 U2.1 28.8,48.67 19.86,48.67 | P9.1 18.74,61.57 19.86,60.45 19.86,56.08 18.74,54.97 18.74,51.51 P8.1 18.64,51.31 18.64,50.6 19.86,49.38 19.86,48.67 | P2.1 18.64,10.87 18.64,14.33 17.53,15.44 17.53,19.81 18.64,20.93 P5.1 18.64,21.03 18.64,24.49 17.53,25.6 17.53,29.97 18.64,31.09 P6.1 | 19.86,48.67 19.86,42.47 18.74,41.35 P7.1 | 42.72,49.48 43.33,49.48 43.54,49.28 43.54,48.77 IC3.5 | 42.72,49.48 42.52,49.28 42.52,48.87 IC3.3 42.52,48.77 42.11,48.77 IC3.2 42.01,48.56 42.01,47.85 29.92,35.76 29.92,34.95 R21.2 | v40.79,52.83 41.5,52.83 IC3.10 | 42.52,50.8 IC3.12 42.62,50.7 42.72,50.6 42.72,49.48 | R4.2 51.46,54.66 53.9,54.66 R15.2 54,54.66 56.44,54.66 R9.2 56.54,54.66 58.37,54.66 R6.2 59.69,53.34 C1.2 61.21,56.79 69.14,64.72 R1.2 | U$8.6 66.09,77.42 67.31,77.42 U$8.7 | U$8.3 66.09,82.6 66.09,77.52 U$8.6 | R1.2 69.24,64.82 73.91,64.82 75.13,66.04 C2.2 | R1.2 69.24,64.92 69.24,66.04 65.58,69.7 C4.- 65.58,69.8 65.99,70.21 65.99,77.32 U$8.6
  Top 0.254: U$1.GND5 69.85,16.66 72.39,16.66 U$1.GND4 72.39,21.44 v75.44,24.49 | 80.21,13.51 80.21,3.96 80.82,3.35 81.74,3.35 82.75,4.37 83.77,4.37 U$1.GND6 | 80.21,13.51 86.31,19.61 U$1.GND1 | v78.18,14.02 79.6,14.02 80.11,13.51 80.21,13.51 | P3.1 77.16,26.31 77.16,32.11 76.96,32.31 P17.1 76.96,32.41 76.96,35.15 81.13,39.32 P14.2 81.23,39.42 81.23,42.57 83.67,45.01 P16.3 83.77,45.11 83.77,52.22 P1.1 83.87,52.32 83.87,58.01 P11.1 83.87,58.12 83.87,63.7 P12.1 83.87,63.8 83.87,69.39 P13.1 83.77,69.49 82.7,70.56 | P4.2 88.95,82.5 88.95,76.91 P15.2 88.85,76.71 82.7,70.56 | 82.7,70.56 77.88,75.39 77.88,77.11 U$4.8
  Bottom 0.254: C25.- 33.98,34.85 29.92,34.85 R21.2 29.82,34.95 20.78,34.95 19.96,35.76 19.86,35.76 | 19.86,35.76 18.74,34.65 18.74,31.19 P6.1 | 19.86,35.76 19.86,40.13 18.74,41.25 P7.1 | v40.79,52.83 40.79,52.53 42.52,50.8 IC3.12 42.62,50.9 47.7,50.9 51.36,54.56 R4.2 | v78.18,14.02 76.05,14.02 73.41,16.66 72.39,16.66 U$1.GND4 | v75.44,24.49 77.16,26.21 P3.1 | C2.2 81.53,66.04 83.77,63.8 P12.1
IMU_ENABLE
  Bottom 0.254: U$1.32-OUT1B 27.99,19.61 28.4,19.61 30.84,17.17 36.12,17.17 36.63,17.68 36.63,25.7 35.2,27.13 35.2,27.94 35.92,28.65 39.98,28.65 46.08,34.75 49.94,34.75 54.51,39.32 78.69,39.32 P14.1
INP
  Top 0.254: 45.16,46.02 43.03,48.16 43.03,48.67 IC3.4 | 45.16,46.02 50.44,46.02 51.36,46.94 R4.1 | U$1.30-CRX3 32.97,19.71 32.97,22.15 28.5,26.62 28.5,29.26 45.16,45.92 45.16,46.02
LED+
  Top 0.254: 74.32,82.91 74.52,82.91 U$4.14 | 74.32,82.91 74.02,82.91 U$4.15 | 76.45,83.41 76.45,82.91 U$4.11 | 76.45,83.41 76.25,83.62 74.93,83.62 74.32,83.01 74.32,82.91 | U$4.2 74.02,77.11 74.52,77.11 U$4.3 74.62,77.22 74.62,77.62 74.93,77.93 76.15,77.93 | 76.15,77.93 76.45,77.62 76.45,77.22 U$4.6 | 78.38,82.6 78.38,80.26 76.15,78.03 76.15,77.93 | 78.38,82.6 78.38,83.41 78.18,83.62 76.76,83.62 76.56,83.41 76.45,83.41 | 78.38,82.6 86.31,82.6 P4.1
LED_PWM
  Top 0.254: U$4.7 77.16,77.11 77.16,44.09 71.17,38.1 71.17,19.71 U$1.5-IN2
MAG_INT
  Top 0.254: U$1.3-LRCLK2 76.15,19.71 76.15,25.7 75.74,26.11 75.74,42.06 78.69,45.01 P16.1
MAG_SCL
  Top 0.254: U$1.16-A2/RX4/SCL1 61.01,4.47 62.03,4.47 72.8,15.24 75.03,15.24 76.35,16.56 76.35,17.07 77.88,18.59 79.2,18.59 80.21,19.61 80.21,25.2 81.03,26.01 81.03,29.87 83.26,32.11 83.26,37.29 85.09,39.12 85.09,43.89 86.21,45.01 P16.4
MAG_SDA  (via drill 0.35)
  Top 0.254: v82.75,18.59 82.75,25.2 83.57,26.01 83.57,29.87 85.8,32.11 85.8,37.29 87.53,39.01 87.53,43.89 88.65,45.01 P16.5
  Bottom 0.254: v82.75,18.59 82.75,16.36 77.67,11.28 77.67,4.37 76.25,2.95 65.38,2.95 63.96,4.37 63.55,4.37 U$1.17-A3/TX4/SDA1
MISO
  Bottom 0.254: U$1.12-MISO/MQSL 53.39,19.71 54.41,19.71 57.15,22.45 75.84,22.45 79.6,26.21 P3.2
MISO1
  Top 0.254: U$1.41-A17/MISO1 48.31,4.47 48.92,4.47 52.78,8.33 65.28,8.33 72.59,15.65 72.9,15.65 73.81,16.56 73.81,17.07 75.34,18.59 76.66,18.59 77.67,19.61 77.67,25.2 78.49,26.01 78.49,31.39 79.4,32.31 P17.2
MOSI
  Bottom 0.254: U$1.11-MOSI/CTX1 55.93,19.71 56.95,19.71 59.28,22.05 77.98,22.05 82.14,26.21 P3.3
MOSI1
  Bottom 0.254: U$1.26-A12/MOSI1 43.23,19.71 44.15,19.71 55.22,30.79 80.31,30.79 81.84,32.31 P17.3
N$1
  Bottom 0.254: C1.1 48.82,48.26 47.6,47.04 46.38,47.04 R7.2
N$2
  Top 0.254: U$4.9 77.77,82.8 77.77,82.4 73.3,77.93 73,77.93 69.24,74.17 69.24,72.44 R1.1
N$5
  Top 0.254: U2.3 29.82,48.56 29.82,36.27 28.09,34.54 28.09,22.05 30.43,19.71 U$1.31-CTX3
N$8
  Top 0.254: U$8.4 64.77,83.21 65.58,84.02 66.5,84.02 66.7,83.82 66.7,79.86 67.92,78.64 67.92,73.05 67.82,72.95 67.82,71.83 68.63,71.02 71.78,71.02 C3.2
N$17
  Top 0.254: R5.2 31.45,48.56 30.94,48.56 U2.5
  Bottom 0.254: R5.2 30.02,43.99 19.76,43.99 17.12,41.35 17.12,15.85 19.86,13.11 19.86,10.97 27.89,2.95 40.69,2.95 41.71,3.96 41.71,4.47 49.12,11.89 62.94,11.89 68.53,6.3 68.53,4.47 U$1.19-A5/SCL0
N$22  (via drill 0.35)
  Top 0.254: U2.4 30.33,48.56 30.33,47.85 32.16,46.02 34.59,46.02 R2.2 35.61,47.04 35.61,52.22 38.15,54.76 42.72,54.76 43.84,53.65 46.79,53.65 52.78,47.65 52.78,46.84 53.59,46.02 54.51,46.02 69.44,31.09 69.44,25.09 64.97,20.62 64.97,19.61 64.36,19 v64.36,9.45
  Bottom 0.254: v64.36,9.45 65.99,7.82 65.99,4.47 U$1.18-A4/SDA0
N$24
  Top 0.254: IC3.9 42.01,52.83 42.01,52.32 41.81,52.12 39.98,52.12 38.76,53.34 C19.1
N$30
  Bottom 0.254: R15.1 53.9,46.94 52.78,46.94 51.87,46.02 44.96,46.02 39.68,51.31 39.68,53.75 22.61,70.81 12.14,70.81 11.94,71.02 10.92,71.02 10.31,70.41 10.31,68.48 11.43,67.36 LED3.K
N$39
  Top 0.254: R9.1 56.54,46.94 57.05,46.94 60.1,43.89 70.46,43.89 LED1.K
N$42
  Top 0.254: 62.89,26.98 65.38,24.49 L2.1 | 62.89,26.98 62.03,27.84 62.03,36.17 60.71,37.49 53.29,37.49 50.24,34.44 50.24,34.04 U$7.11 | 62.89,26.98 60.81,24.89 59.79,24.89 58.67,26.01 57.15,26.01 D2.C
N$46
  Top 0.254: R21.1 30.84,26.31 49.33,26.31 50.75,27.74 50.75,28.14 U$7.5
O1_RX  (via drill 0.35)
  Top 0.254: v78.38,10.77 78.38,8.13 74.73,4.47 74.73,3.96 72.49,1.73 21.08,1.73 17.53,5.28 17.53,7.11 18.64,8.23 P2.2
  Bottom 0.254: v78.38,10.77 83.77,16.15 83.77,19.61 U$1.0-RX1/CS1/CRX2
O1_TX
  Top 0.254: U$1.1-TX1/MISO1/CTX2 81.23,19.61 81.23,19.41 78.59,16.76 78.59,15.44 74.32,11.18 74.32,6.6 72.19,4.47 72.19,3.96 70.36,2.13 22.3,2.13 18.74,5.69 P2.3
O2_RX  (via drill 0.35)
  Top 0.254: v42.93,16.05 47.8,16.05 55.12,8.74 64.67,8.74 65.99,10.06 65.99,19.61 U$1.7-RX2/OUT1A | v22,16.05 21.08,16.05 18.74,18.39 P5.2
  Bottom 0.254: v22,16.05 v42.93,16.05
O2_TX
  Bottom 0.254: U$1.8-TX2/IN1 63.45,19.61 62.43,19.61 55.12,12.29 47.9,12.29 41.1,5.49 32.56,5.49 31.55,4.47 31.55,3.96 30.94,3.35 30.02,3.35 29.01,4.37 29.01,5.59 18.74,15.85 P5.3
O3_RX  (via drill 0.35)
  Top 0.254: v51.66,11.18 46.79,11.18 41.91,16.05 37.64,16.05 v35.81,17.88
  Bottom 0.254: v51.66,11.18 58.37,4.47 U$1.15-A1/RX3/SPDIF_IN | v35.81,17.88 30.73,17.88 29.01,19.61 29.01,20.12 20.57,28.55 18.74,28.55 P6.2
O3_TX
  Top 0.254: U$1.14-A0/TX3/SPDIF_OUT 55.83,4.37 55.42,4.37 53.59,2.54 33.38,2.54 31.55,4.37 31.55,13.21 18.74,26.01 P6.3
O4_RX
  Bottom 0.254: U$1.34-RX8 30.43,4.47 30.43,6.6 19.86,17.17 19.86,23.27 17.53,25.6 17.53,37.59 18.64,38.71 P7.2
O4_TX
  Top 0.254: U$1.35-TX8 32.97,4.47 32.97,12.5 20.78,24.69 20.78,34.14 18.74,36.17 P7.3
O5_RX  (via drill 0.35)
  Top 0.254: v70.97,18.29 69.85,19.41 69.85,31.7 v59.89,41.66
  Bottom 0.254: v70.97,18.29 70.97,16.56 72.29,15.24 72.29,6.81 73.61,5.49 73.61,4.47 U$1.21-A7/RX5/BCLK1 | v59.89,41.66 42.32,41.66 31.65,52.32 22.1,52.32 18.74,48.97 P8.2
O5_TX  (via drill 0.35)
  Top 0.254: v20.57,44.7 25.55,39.73 25.55,20.52 39.17,6.91 39.17,4.37 40.59,2.95 53.39,2.95 54.41,3.96 54.41,4.47 55.42,5.49 56.34,5.49 56.95,4.88 56.95,4.37 57.96,3.35 69.04,3.35 70.05,4.37 71.07,4.37 U$1.20-A6/TX5/LRCLK1
  Bottom 0.254: v20.57,44.7 20.37,44.7 18.74,46.33 P8.3
O6_RX  (via drill 0.35)
  Top 0.254: v20.07,26.01 20.07,33.22 17.12,36.17 17.12,57.51 18.64,59.03 P9.2
  Bottom 0.254: v20.07,26.01 29.31,16.76 36.32,16.76 37.74,18.19 43.23,18.19 44.65,19.61 45.67,19.61 U$1.25-A11/RX6/SDA2
O6_TX  (via drill 0.35)
  Top 0.254: v34.49,24.59 34.49,19.2 35.1,18.59 46.18,18.59 47.19,19.61 48.21,19.61 U$1.24-A10/TX6/SCL2 | v24.84,34.24 18.95,40.13 18.14,40.13 17.53,40.74 17.53,55.37 18.64,56.49 P9.3
  Bottom 0.254: v24.84,34.24 v34.49,24.59
PMS+  (via drill 0.35)
  Top 0.254: 42.32,28.55 43.23,28.55 44.45,27.33 R20.1 | 42.32,28.55 41.3,28.55 C26.1 | v48.82,35.46 48.82,34.04 U$7.13 | v42.32,32.92 42.32,28.55 | 29.16,51.97 29.11,51.92 28.6,51.92 25.15,55.37 25.15,74.07 24.33,74.88 SJ5.1 | 29.16,51.97 29.31,52.12 29.31,52.93 U2.9 | 29.16,51.97 v29.52,51.61
  Bottom 0.254: v48.82,35.46 45.26,35.46 44.86,35.87 42.32,35.87 | 37.34,35.87 42.32,35.87 | 37.34,35.87 36.22,34.75 C25.+ | 42.32,35.87 v42.32,32.92 | 37.34,35.87 37.34,43.79 33.98,47.14 33.98,47.45 29.82,51.61 v29.52,51.61
POWER+  (via drill 0.35)
  Top 1.575: CON2.+ 11.43,8.33 11.43,13.31 C16.1 11.43,17.68 CON1.+ 11.43,18.49 11.43,23.47 C9.1 11.43,27.84 CON3.+ 11.43,28.65 11.43,33.63 C10.1 11.43,38 CON4.+ 11.43,38.81 11.43,43.79 C11.1 11.43,48.16 CON5.+ 11.43,48.97 11.43,53.95 C12.1 11.43,58.32 CON6.+ 11.43,59.13 C13.1 11.43,64.21 18.95,71.73 21.18,71.73 | 21.18,71.73 22.71,71.73 SJ3.2 | v21.18,71.93 21.18,71.73
  Bottom 1.575: U$5.1 57.76,85.65 57.76,84.84 56.03,83.11 48.41,83.11 46.99,84.53 U$2.1 46.28,85.65 46.28,84.84 44.55,83.11 40.49,83.11 37.95,85.65 35,85.65 U$3.1 34.7,84.94 34.7,84.63 22,71.93 v21.18,71.93
RXD  (via drill 0.35)
  Top 0.254: v67.61,31.9 67.61,24.99 65.89,23.27 40.18,23.27 36.63,19.71 35.61,19.71 U$1.29-TX7
  Bottom 0.254: v67.61,31.9 72.9,31.9 80.01,39.01 80.01,39.83 80.72,40.54 85.09,40.54 86.21,39.42 P14.4
SCK
  Bottom 0.254: U$1.13-SCK/LED 53.39,4.37 54.41,4.37 55.42,3.35 61.42,3.35 62.43,4.37 62.43,4.88 63.04,5.49 63.96,5.49 64.97,4.47 64.97,3.96 65.58,3.35 74.12,3.35 75.13,4.37 75.13,9.96 78.89,13.72 78.89,18.29 80.21,19.61 80.21,20.12 86.31,26.21 87.12,26.21 P3.5
SCK1  (via drill 0.35)
  Top 0.254: v68.73,25.4 66.19,22.86 44.86,22.86 41.71,19.71 40.69,19.71 U$1.27-A13/SCK1
  Bottom 0.254: v68.73,25.4 74.62,25.4 78.79,29.57 84.18,29.57 86.92,32.31 P17.5
SENS1
  Bottom 0.254: U$1.22-A8/CTX1 76.25,4.47 76.25,10.46 82.04,16.26 82.04,18.9 82.75,19.61 82.75,20.22 88.34,25.81 88.34,31.9 88.24,32 88.24,37.29 89.86,38.91 89.86,51.41 88.95,52.32 P1.3
SENS2
  Bottom 0.254: U$1.23-A9/CRX1/MCLK1 78.79,4.47 78.79,10.16 90.88,22.25 90.88,56.08 88.95,58.01 P11.3
SENS3  (via drill 0.35)
  Top 0.254: v42.01,9.65 42.01,6.81 40.69,5.49 40.69,4.47 U$1.38-A14/CS/IN1 | v82.55,37.49 82.55,42.27 85.09,44.81 85.09,55.17 87.73,57.81 87.73,62.59 88.85,63.7 P12.3
  Bottom 0.254: v42.01,9.65 42.01,11.89 49.73,19.61 49.73,20.42 59.69,30.38 81.53,30.38 83.06,31.9 83.06,36.98 v82.55,37.49
SENS4
  Bottom 0.254: U$1.39-A15/CS/OUT1A 43.23,4.37 44.25,4.37 46.08,2.54 86.11,2.54 91.69,8.13 91.69,66.65 88.95,69.39 P13.3
SHDN  (via drill 0.35)
  Top 0.254: U$8.5 64.77,70.31 64.57,70.1 64.57,69.29 65.18,68.68 65.89,68.68 66.5,68.07 66.5,67.26 54.81,55.58 51.05,55.58 50.44,54.97 50.44,54.25 56.74,47.95 57.45,47.95 R6.1 | v68.53,23.16 68.53,19.71 U$1.6-OUT1D | v62.74,28.96 62.74,36.78 v56.44,43.08
  Bottom 0.254: v62.74,28.96 v68.53,23.16 | v56.44,43.08 56.44,45.01 R6.1
SWTCH  (via drill 0.35)
  Top 0.254: R20.2 44.45,34.85 45.26,34.04 48.21,34.04 U$7.14 48.11,34.14 48.11,35.76 52.38,40.03 52.38,47.45 50.85,48.97 v50.44,48.97
  Bottom 0.254: v50.44,48.97 52.38,50.9 52.38,55.88 65.18,68.68 66.9,68.68 75.03,76.81 86.31,76.81 P15.1
T3.3V
  Top 0.254: U$1.3V3-3 81.33,4.47 81.33,12.7 89.66,21.03 89.66,26.21 P3.6 89.66,26.31 89.46,26.52 89.46,32.31 P17.6
TGUP
  Top 0.254: IC3.7 43.13,52.83 43.13,52.22 43.23,52.12 43.74,52.12 48.82,47.04 R10.1
TS
  Top 0.254: IC3.8 42.52,52.93 42.52,53.54 41.71,54.36 38.35,54.36 37.74,53.75 37.74,49.17 38.66,48.26 C19.2 | SJ3.1 24.23,71.83 24.23,72.14 23.32,73.05 14.58,73.05 11.43,69.9 LED3.A
  Bottom 0.254: C19.2 36.32,48.26 14.78,69.8 11.43,69.8 LED3.A
TXD
  Bottom 0.254: U$1.28-RX7 38.15,19.71 39.17,19.71 48.31,28.85 52.68,28.85 55.02,31.19 74.12,31.19 81.13,38.2 82.55,38.2 83.67,39.32 P14.3
V+  (1 unrouted)
  Top 0.254: SJ1.2 28.8,76.1 28.8,53.03 U2.10

### Text on the board
tNames: 1.1 | Cerebellar / Jochen Alt